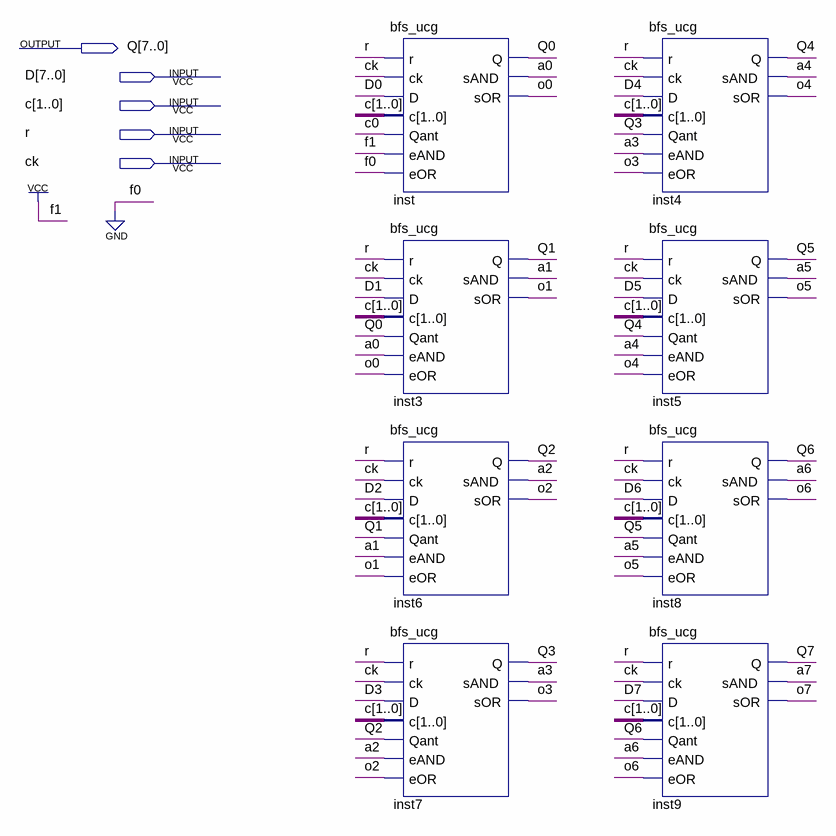
[diagram p0: schematic sheet]
// Quartus schematic bfs_contGen.bdf as structural Verilog: 8 symbols, 5 pins
module bfs_contGen (
  input  [7:0] D,
  input  [1:0] c,
  input  r,
  input  ck,
  output [7:0] Q
);

  wire a0, a1, a2, a3, a4, a5, a6, a7, o0, o1, o2, o3, o4, o5, o6, o7;

  bfs_ucg inst (.r(r), .ck(ck), .D(D[0]), .c(c), .Qant(c[0]), .eAND(1'b1), .eOR(1'b0), .Q(Q[0]), .sAND(a0), .sOR(o0));
  bfs_ucg inst3 (.r(r), .ck(ck), .D(D[1]), .c(c), .Qant(Q[0]), .eAND(a0), .eOR(o0), .Q(Q[1]), .sAND(a1), .sOR(o1));
  bfs_ucg inst6 (.r(r), .ck(ck), .D(D[2]), .c(c), .Qant(Q[1]), .eAND(a1), .eOR(o1), .Q(Q[2]), .sAND(a2), .sOR(o2));
  bfs_ucg inst7 (.r(r), .ck(ck), .D(D[3]), .c(c), .Qant(Q[2]), .eAND(a2), .eOR(o2), .Q(Q[3]), .sAND(a3), .sOR(o3));
  bfs_ucg inst4 (.r(r), .ck(ck), .D(D[4]), .c(c), .Qant(Q[3]), .eAND(a3), .eOR(o3), .Q(Q[4]), .sAND(a4), .sOR(o4));
  bfs_ucg inst5 (.r(r), .ck(ck), .D(D[5]), .c(c), .Qant(Q[4]), .eAND(a4), .eOR(o4), .Q(Q[5]), .sAND(a5), .sOR(o5));
  bfs_ucg inst8 (.r(r), .ck(ck), .D(D[6]), .c(c), .Qant(Q[5]), .eAND(a5), .eOR(o5), .Q(Q[6]), .sAND(a6), .sOR(o6));
  bfs_ucg inst9 (.r(r), .ck(ck), .D(D[7]), .c(c), .Qant(Q[6]), .eAND(a6), .eOR(o6), .Q(Q[7]), .sAND(a7), .sOR(o7));
endmodule
